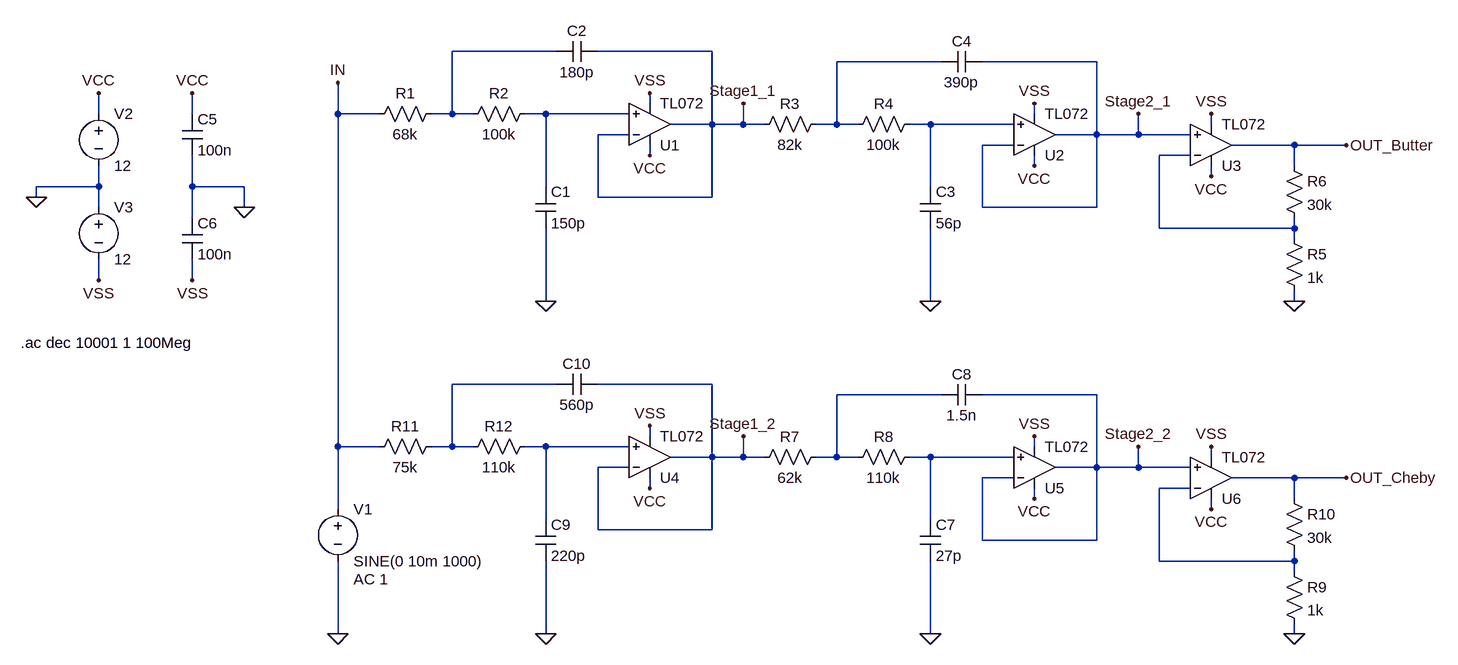
[diagram p0: schematic SK_ordnung4_10kHz_1dB_30dB_butter_cheby_3OPV.asc]
SK_ordnung4_10kHz_1dB_30dB_butter_cheby_3OPV.asc, the LTspice schematic file:
Version 4
SHEET 1 1212 1012
WIRE -160 96 -320 96
WIRE 80 96 -96 96
WIRE 432 112 272 112
WIRE 672 112 496 112
WIRE -16 176 -16 160
WIRE -864 192 -864 160
WIRE -720 192 -720 160
WIRE -496 192 -496 144
WIRE -432 192 -496 192
WIRE -320 192 -320 96
WIRE -320 192 -352 192
WIRE -288 192 -320 192
WIRE -176 192 -208 192
WIRE -48 192 -176 192
WIRE 576 192 576 176
WIRE 80 208 80 96
WIRE 80 208 16 208
WIRE 128 208 128 176
WIRE 128 208 80 208
WIRE 160 208 128 208
WIRE 272 208 272 112
WIRE 272 208 240 208
WIRE 304 208 272 208
WIRE 416 208 384 208
WIRE 544 208 416 208
WIRE 848 208 848 192
WIRE -48 224 -96 224
WIRE 672 224 672 112
WIRE 672 224 608 224
WIRE 736 224 736 192
WIRE 736 224 672 224
WIRE 816 224 736 224
WIRE 544 240 496 240
WIRE 976 240 880 240
WIRE 1056 240 976 240
WIRE -16 256 -16 240
WIRE 816 256 768 256
WIRE 576 272 576 256
WIRE 976 272 976 240
WIRE 848 288 848 272
WIRE -864 304 -864 272
WIRE -864 304 -960 304
WIRE -720 304 -720 256
WIRE -640 304 -720 304
WIRE -176 304 -176 192
WIRE 416 304 416 208
WIRE -960 320 -960 304
WIRE -96 320 -96 224
WIRE 80 320 80 208
WIRE 80 320 -96 320
WIRE -864 336 -864 304
WIRE -640 336 -640 304
WIRE 496 336 496 240
WIRE 672 336 672 224
WIRE 672 336 496 336
WIRE -720 352 -720 304
WIRE 768 368 768 256
WIRE 976 368 976 352
WIRE 976 368 768 368
WIRE 976 384 976 368
WIRE -864 448 -864 416
WIRE -720 448 -720 416
WIRE -176 480 -176 368
WIRE 416 480 416 368
WIRE 976 480 976 464
WIRE -160 608 -320 608
WIRE 80 608 -96 608
WIRE 432 624 272 624
WIRE 672 624 496 624
WIRE -16 688 -16 672
WIRE -496 704 -496 192
WIRE -432 704 -496 704
WIRE -320 704 -320 608
WIRE -320 704 -352 704
WIRE -288 704 -320 704
WIRE -176 704 -208 704
WIRE -48 704 -176 704
WIRE 576 704 576 688
WIRE 80 720 80 608
WIRE 80 720 16 720
WIRE 128 720 128 688
WIRE 128 720 80 720
WIRE 160 720 128 720
WIRE 272 720 272 624
WIRE 272 720 240 720
WIRE 304 720 272 720
WIRE 416 720 384 720
WIRE 544 720 416 720
WIRE 848 720 848 704
WIRE -48 736 -96 736
WIRE 672 736 672 624
WIRE 672 736 608 736
WIRE 736 736 736 704
WIRE 736 736 672 736
WIRE 816 736 736 736
WIRE 544 752 496 752
WIRE 976 752 880 752
WIRE 1056 752 976 752
WIRE -16 768 -16 752
WIRE 816 768 768 768
WIRE 576 784 576 768
WIRE 976 784 976 752
WIRE -496 800 -496 704
WIRE 848 800 848 784
WIRE -176 816 -176 704
WIRE 416 816 416 720
WIRE -96 832 -96 736
WIRE 80 832 80 720
WIRE 80 832 -96 832
WIRE 496 848 496 752
WIRE 672 848 672 736
WIRE 672 848 496 848
WIRE 768 880 768 768
WIRE 976 880 976 864
WIRE 976 880 768 880
WIRE 976 896 976 880
WIRE -496 992 -496 880
WIRE -176 992 -176 880
WIRE 416 992 416 880
WIRE 976 992 976 976
FLAG 976 480 0
FLAG 416 480 0
FLAG -176 480 0
FLAG -864 160 VCC
FLAG -864 448 VSS
FLAG -16 160 VSS
FLAG 576 176 VSS
FLAG 848 192 VSS
FLAG -16 256 VCC
FLAG 576 272 VCC
FLAG 848 288 VCC
FLAG -960 320 0
FLAG -720 160 VCC
FLAG -720 448 VSS
FLAG -640 336 0
FLAG 1056 240 OUT_Butter
FLAG 736 192 Stage2_1
FLAG 128 176 Stage1_1
FLAG -496 144 IN
FLAG 976 992 0
FLAG 416 992 0
FLAG -176 992 0
FLAG -16 672 VSS
FLAG 576 688 VSS
FLAG 848 704 VSS
FLAG -16 768 VCC
FLAG 576 784 VCC
FLAG 848 800 VCC
FLAG -496 992 0
FLAG 1056 752 OUT_Cheby
FLAG 736 704 Stage2_2
FLAG 128 688 Stage1_2
SYMBOL res 256 192 R90
WINDOW 0 0 56 VBottom 2
WINDOW 3 32 56 VTop 2
SYMATTR InstName R3
SYMATTR Value 82k
SYMBOL res 400 192 R90
WINDOW 0 0 56 VBottom 2
WINDOW 3 32 56 VTop 2
SYMATTR InstName R4
SYMATTR Value 100k
SYMBOL res 960 368 R0
SYMATTR InstName R5
SYMATTR Value 1k
SYMBOL res 960 256 R0
SYMATTR InstName R6
SYMATTR Value 30k
SYMBOL cap 400 304 R0
SYMATTR InstName C3
SYMATTR Value 56p
SYMBOL cap 496 96 R90
WINDOW 0 0 32 VBottom 2
WINDOW 3 32 32 VTop 2
SYMATTR InstName C4
SYMATTR Value 390p
SYMBOL res -336 176 R90
WINDOW 0 0 56 VBottom 2
WINDOW 3 32 56 VTop 2
SYMATTR InstName R1
SYMATTR Value 68k
SYMBOL res -192 176 R90
WINDOW 0 0 56 VBottom 2
WINDOW 3 32 56 VTop 2
SYMATTR InstName R2
SYMATTR Value 100k
SYMBOL cap -192 304 R0
SYMATTR InstName C1
SYMATTR Value 150p
SYMBOL cap -96 80 R90
WINDOW 0 0 32 VBottom 2
WINDOW 3 32 32 VTop 2
SYMATTR InstName C2
SYMATTR Value 180p
SYMBOL voltage -864 176 R0
WINDOW 123 0 0 Left 0
WINDOW 39 0 0 Left 0
SYMATTR InstName V2
SYMATTR Value 12
SYMBOL voltage -864 320 R0
WINDOW 123 0 0 Left 0
WINDOW 39 0 0 Left 0
SYMATTR InstName V3
SYMATTR Value 12
SYMBOL cap -736 192 R0
SYMATTR InstName C5
SYMATTR Value 100n
SYMBOL cap -736 352 R0
SYMATTR InstName C6
SYMATTR Value 100n
SYMBOL TL072 -16 272 M180
SYMATTR InstName U1
SYMBOL TL072 576 288 M180
SYMATTR InstName U2
SYMBOL TL072 848 304 M180
SYMATTR InstName U3
SYMBOL res 256 704 R90
WINDOW 0 0 56 VBottom 2
WINDOW 3 32 56 VTop 2
SYMATTR InstName R7
SYMATTR Value 62k
SYMBOL res 400 704 R90
WINDOW 0 0 56 VBottom 2
WINDOW 3 32 56 VTop 2
SYMATTR InstName R8
SYMATTR Value 110k
SYMBOL res 960 880 R0
SYMATTR InstName R9
SYMATTR Value 1k
SYMBOL res 960 768 R0
SYMATTR InstName R10
SYMATTR Value 30k
SYMBOL cap 400 816 R0
SYMATTR InstName C7
SYMATTR Value 27p
SYMBOL cap 496 608 R90
WINDOW 0 0 32 VBottom 2
WINDOW 3 32 32 VTop 2
SYMATTR InstName C8
SYMATTR Value 1.5n
SYMBOL res -336 688 R90
WINDOW 0 0 56 VBottom 2
WINDOW 3 32 56 VTop 2
SYMATTR InstName R11
SYMATTR Value 75k
SYMBOL res -192 688 R90
WINDOW 0 0 56 VBottom 2
WINDOW 3 32 56 VTop 2
SYMATTR InstName R12
SYMATTR Value 110k
SYMBOL cap -192 816 R0
SYMATTR InstName C9
SYMATTR Value 220p
SYMBOL cap -96 592 R90
WINDOW 0 0 32 VBottom 2
WINDOW 3 32 32 VTop 2
SYMATTR InstName C10
SYMATTR Value 560p
SYMBOL voltage -496 784 R0
WINDOW 123 24 124 Left 2
WINDOW 39 0 0 Left 0
SYMATTR Value2 AC 1
SYMATTR InstName V1
SYMATTR Value SINE(0 10m 1000)
SYMBOL TL072 -16 784 M180
SYMATTR InstName U4
SYMBOL TL072 576 800 M180
SYMATTR InstName U5
SYMBOL TL072 848 816 M180
SYMATTR InstName U6
TEXT -984 544 Left 2 !.ac dec 10001 1 100Meg

The netlist it stands for:
* SK_ordnung4_10kHz_1dB_30dB_butter_cheby_3OPV.asc
R3 N002 Stage1_1 82k
R4 N004 N002 100k
R5 N005 0 1k
R6 OUT_Butter N005 30k
C3 N004 0 56p
C4 Stage2_1 N002 390p
R1 N001 IN 68k
R2 N003 N001 100k
C1 N003 0 150p
C2 Stage1_1 N001 180p
V2 VCC 0 12
V3 0 VSS 12
C5 VCC 0 100n
C6 0 VSS 100n
* U1: TL072 (symbol TL072 not available, pins judged from their places): In+=N003 In-=Stage1_1 V+=VCC V-=VSS OUT=Stage1_1
* U2: TL072 (symbol TL072 not available, pins judged from their places): In+=N004 In-=Stage2_1 V+=VCC V-=VSS OUT=Stage2_1
* U3: TL072 (symbol TL072 not available, pins judged from their places): In+=Stage2_1 In-=N005 V+=VCC V-=VSS OUT=OUT_Butter
R7 N007 Stage1_2 62k
R8 N009 N007 110k
R9 N010 0 1k
R10 OUT_Cheby N010 30k
C7 N009 0 27p
C8 Stage2_2 N007 1.5n
R11 N006 IN 75k
R12 N008 N006 110k
C9 N008 0 220p
C10 Stage1_2 N006 560p
V1 IN 0 SINE(0 10m 1000) AC 1
* U4: TL072 (symbol TL072 not available, pins judged from their places): In+=N008 In-=Stage1_2 V+=VCC V-=VSS OUT=Stage1_2
* U5: TL072 (symbol TL072 not available, pins judged from their places): In+=N009 In-=Stage2_2 V+=VCC V-=VSS OUT=Stage2_2
* U6: TL072 (symbol TL072 not available, pins judged from their places): In+=Stage2_2 In-=N010 V+=VCC V-=VSS OUT=OUT_Cheby
.ac dec 10001 1 100Meg
.backanno
.end